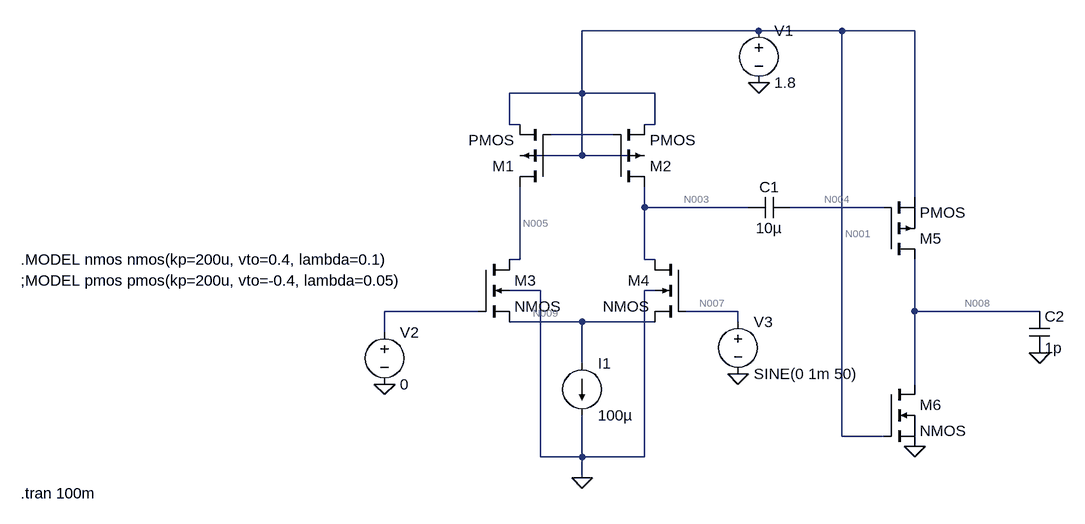
[diagram p0: schematic 2StageOpAmp.asc]
2StageOpAmp.asc, the LTspice schematic file:
Version 4
SHEET 1 880 760
WIRE 208 32 -64 32
WIRE 336 32 208 32
WIRE 448 32 336 32
WIRE -64 128 -64 32
WIRE -64 128 -176 128
WIRE 48 128 -64 128
WIRE -176 176 -176 128
WIRE -160 176 -176 176
WIRE 48 176 48 128
WIRE 48 176 32 176
WIRE -16 192 -112 192
WIRE -64 224 -64 128
WIRE -64 224 -160 224
WIRE 32 224 -64 224
WIRE 448 288 448 32
WIRE 32 304 32 272
WIRE 192 304 32 304
WIRE 400 304 256 304
WIRE -160 384 -160 272
WIRE -160 384 -176 384
WIRE 32 384 32 304
WIRE 48 384 32 384
WIRE -128 432 -176 432
WIRE 48 432 32 432
WIRE -224 464 -368 464
WIRE 176 464 96 464
WIRE 448 464 448 384
WIRE 640 464 448 464
WIRE -64 480 -176 480
WIRE 48 480 -64 480
WIRE 176 480 176 464
WIRE -368 496 -368 464
WIRE -64 544 -64 480
WIRE 448 576 448 464
WIRE 336 656 336 32
WIRE 400 656 336 656
WIRE -128 688 -128 432
WIRE -64 688 -64 624
WIRE -64 688 -128 688
WIRE 32 688 32 432
WIRE 32 688 -64 688
WIRE -64 720 -64 688
FLAG 208 112 0
FLAG -368 576 0
FLAG 176 560 0
FLAG -64 720 0
FLAG 448 672 0
FLAG 640 528 0
SYMBOL voltage 208 16 R0
WINDOW 123 0 0 Left 0
WINDOW 39 0 0 Left 0
SYMATTR InstName V1
SYMATTR Value 1.8
SYMBOL nmos4 -224 384 R0
SYMATTR InstName M3
SYMBOL nmos4 96 384 M0
SYMATTR InstName M4
SYMBOL voltage -368 480 R0
WINDOW 123 0 0 Left 0
WINDOW 39 0 0 Left 0
SYMATTR InstName V2
SYMATTR Value 0
SYMBOL voltage 176 464 R0
WINDOW 123 0 0 Left 0
WINDOW 39 0 0 Left 0
SYMATTR InstName V3
SYMATTR Value SINE(0 1m 50)
SYMBOL current -64 544 R0
WINDOW 123 0 0 Left 0
WINDOW 39 0 0 Left 0
SYMATTR InstName I1
SYMATTR Value 100µ
SYMBOL pmos4 -112 272 R180
SYMATTR InstName M1
SYMBOL pmos4 -16 272 M180
SYMATTR InstName M2
SYMBOL pmos 400 384 M180
SYMATTR InstName M5
SYMBOL nmos 400 576 R0
SYMATTR InstName M6
SYMBOL cap 256 288 R90
WINDOW 0 0 32 VBottom 2
WINDOW 3 32 32 VTop 2
SYMATTR InstName C1
SYMATTR Value 10µ
SYMBOL cap 624 464 R0
SYMATTR InstName C2
SYMATTR Value 1p
TEXT -928 384 Left 2 !.MODEL nmos nmos(kp=200u, vto=0.4, lambda=0.1)
TEXT -928 744 Left 2 !.tran 100m
TEXT -928 416 Left 2 !;MODEL pmos pmos(kp=200u, vto=-0.4, lambda=0.05)

The netlist it stands for:
* 2StageOpAmp.asc
V1 N001 0 1.8
M3 N005 N006 N009 0 NMOS
M4 N003 N007 N009 0 NMOS
V2 N006 0 0
V3 N007 0 SINE(0 1m 50)
I1 N009 0 100µ
M1 N005 N002 N001 N001 PMOS
M2 N003 N002 N001 N001 PMOS
M5 N008 N004 N001 N001 PMOS
M6 N008 N001 0 0 NMOS
C1 N004 N003 10µ
C2 N008 0 1p
.model NMOS NMOS
.model PMOS PMOS
.lib standard.mos
.MODEL nmos nmos(kp=200u, vto=0.4, lambda=0.1)
.tran 100m
;MODEL pmos pmos(kp=200u, vto=-0.4, lambda=0.05)
.backanno
.end

* Results of the author's LTspice run, read from the files saved beside the schematic
* Operating Point, zero values left out:
*   V(n001) = 1.8 V
*   V(n005) = 1.692 V
*   V(n009) = -575.6 mV
*   V(n003) = 1.692 V
*   V(n008) = 118.9 mV
*   V(n004) = 16.92 µV
*   Id(M5) = -32.26 µA
*   Ib(M5) = 1.691 pA
*   Is(M5) = 32.26 µA
*   Id(M2) = -3.783 µA
*   Is(M2) = 3.783 µA
*   Id(M1) = -3.783 µA
*   Is(M1) = 3.783 µA
*   Id(M6) = 32.26 µA
*   Is(M6) = -32.26 µA
*   Id(M4) = 3.783 µA
*   Ib(M4) = 46.22 µA
*   Is(M4) = -50 µA
*   Id(M3) = 3.783 µA
*   Ib(M3) = 46.22 µA
*   Is(M3) = -50 µA
*   I(I1) = 100 µA
*   I(V1) = -39.82 µA
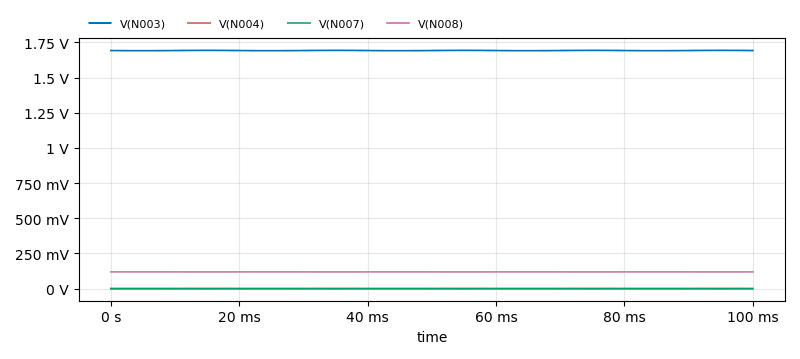
[diagram p1: Transient Analysis of 2StageOpAmp.asc, plotted from the saved traces]
* Transient Analysis, 1 run:
*   V(N003): min 1.69 V, max 1.693 V, average 1.692 V, rms 1.692 V, last 1.692 V
*   V(N004): min -1.222 mV, max 1.232 mV, average 23.21 µV, rms 865.9 µV, last 16.92 µV
*   V(N007): min -977.6 µV, max 990.6 µV, average -6.508 µV, rms 694.3 µV, last 0 V
*   V(N008): min 118.7 mV, max 119.1 mV, average 118.9 mV, rms 118.9 mV, last 118.9 mV